# EAGLE design GDEnvSensorNode_1_4b (EAGLE 8.2.1)
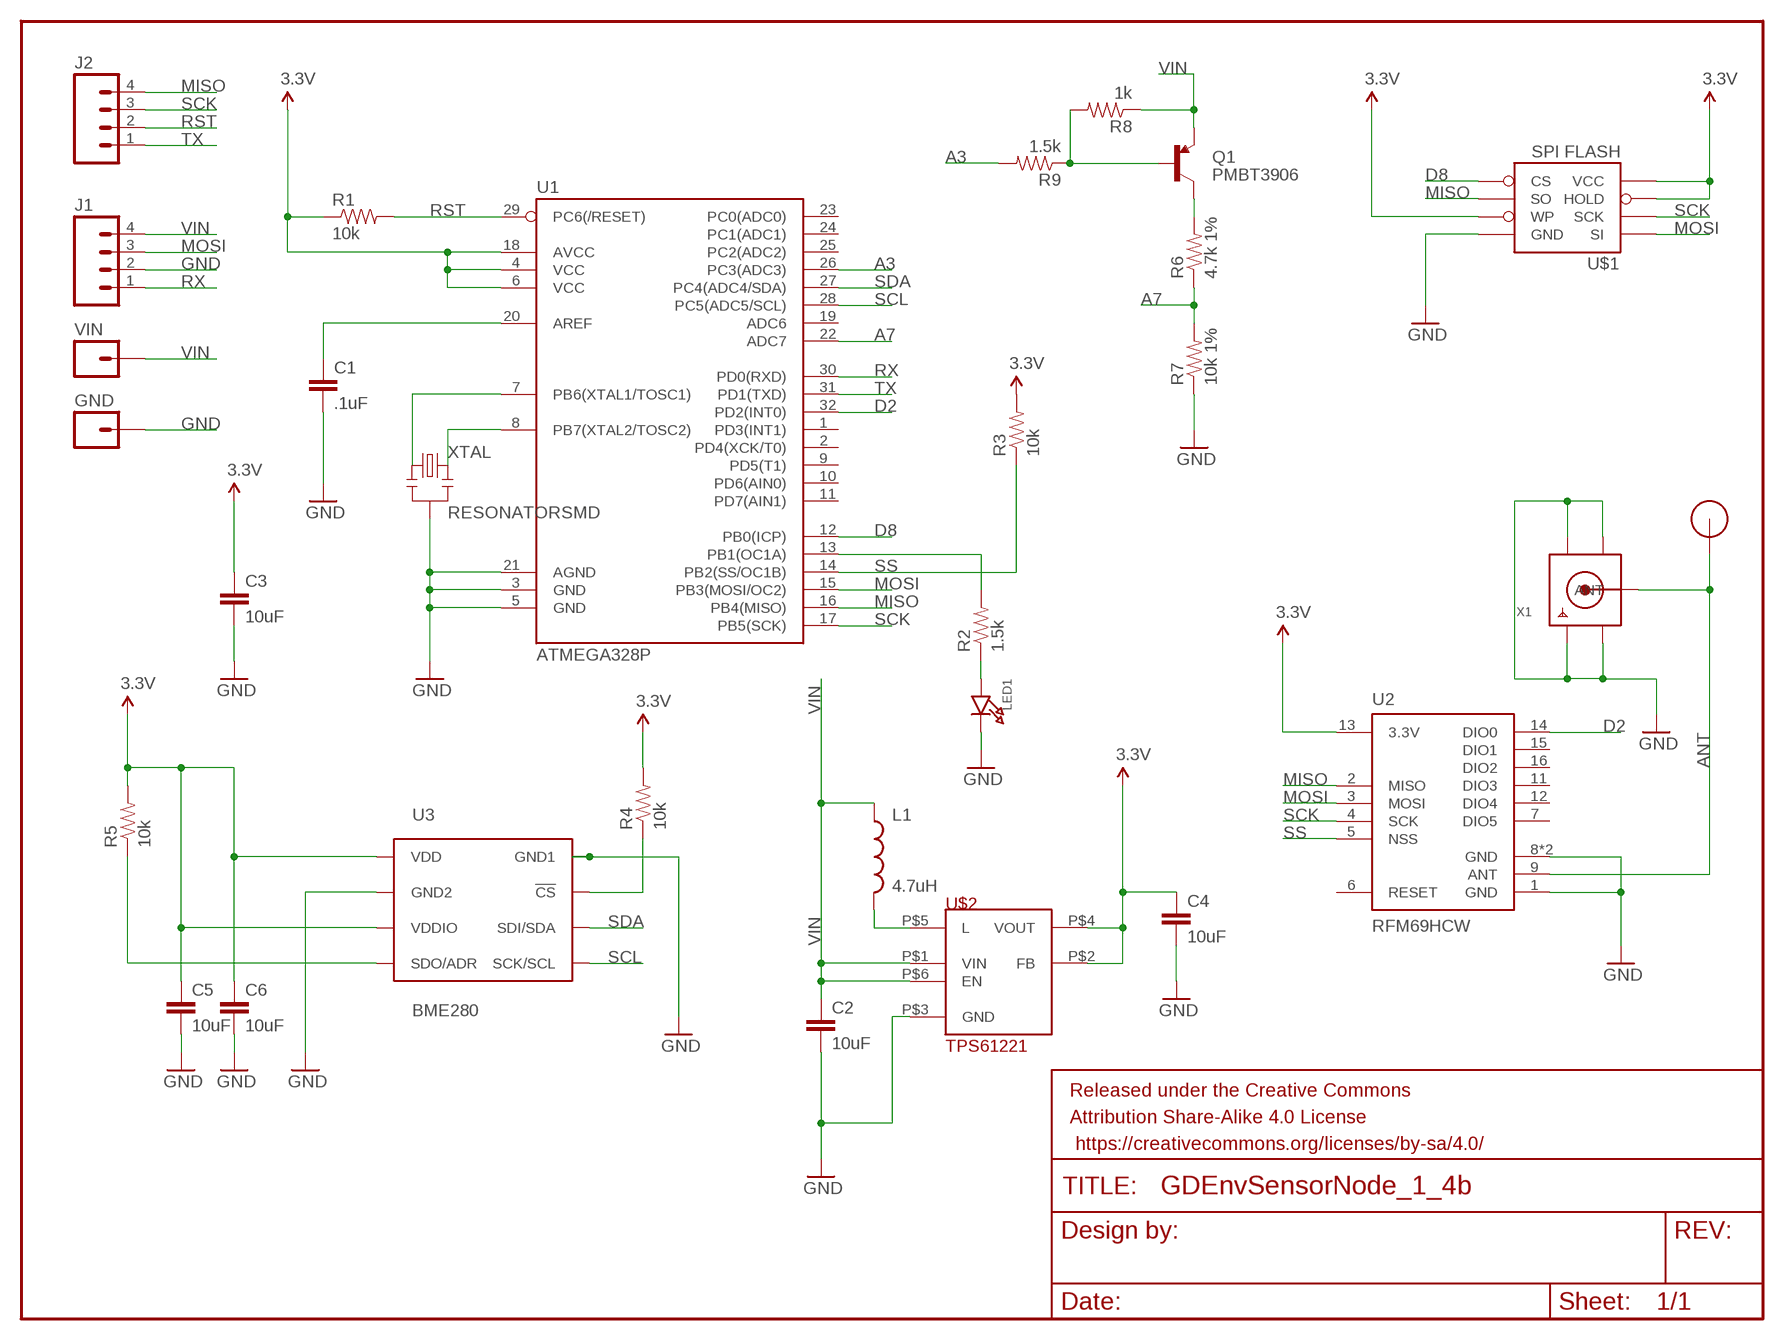
[diagram p0: schematic, sheet 1]

## Parts
C1  .1uF  CAP0805  [0805]
C2  10uF  CAP0805  [0805]
C3  10uF  CAP0805  [0805]
C4  10uF  CAP0805  [0805]
C5  10uF  CAP0805  [0805]
C6  10uF  CAP0805  [0805]
FRAME1  FRAME-LETTER  [CREATIVE_COMMONS]
GND  M01PTH_2MM  [1X01_2MM]
J1  M04PTH  [1X04]
J2  M04PTH  [1X04]
L1  4.7uH  INDUCTOR1210  [1210]
LED1  LED0805  [CHIPLED_0805]
Q1  PMBT3906  TRANSISTOR_PNPPMBT3906  [SOT23-3]
R1  10k  RESISTOR0805-RES  [0805]
R2  1.5k  RESISTOR0805-RES  [0805]
R3  10k  RESISTOR0805-RES  [0805]
R4  10k  RESISTOR0805-RES  [0805]
R5  10k  RESISTOR0805-RES  [0805]
R6  4.7k 1%  RESISTOR0805-RES  [0805]
R7  10k 1%  RESISTOR0805-RES  [0805]
R8  1k  RESISTOR0805-RES  [0805]
R9  1.5k  RESISTOR0805-RES  [0805]
U1  ATMEGA328P  ATMEGA328P_TQFP  [TQFP32-08]
U2  RFM69HCW  [RFM69HCW-XXXS2]
U3  BME280  [BME280_LGA]
U$1  SPI FLASH  AT25F512BJEDEC_3.9MM  [SO08]
U$2  TPS61221  [TPS61221]
U$4  RFM12B_ANTENNA  [RFM12B-ANTENNA]
VIN  M01PTH_2MM  [1X01_2MM]
X1  SMACONNECTOR_EDGE_UFL  [SMA_EDGELAUNCH_UFL]
XTAL  RESONATORSMD  [RESONATOR-SMD]

## Nets
3.3V: C3.1 C4.1 R1.1 R3.2 R4.2 U1.4(VCC) U1.6(VCC) U1.18(AVCC) U2.13(3.3V) U$1.3_WP(WP) U$1.7_HOLD(HOLD) U$1.8_VCC(VCC) U$2.P$2(FB) U$2.P$4(VOUT)
A3: R9.2 U1.26(PC3(ADC3))
A7: R6.1 R7.2 U1.22(ADC7)
ANT: U2.9(ANT) U$4.P$1 X1.P(ANT)
D2: U1.32(PD2(INT0)) U2.14(DIO0)
D8: U1.12(PB0(ICP)) U$1.1_CS(CS)
GND: C1.2 C2.2 C3.2 C4.2 C5.2 C6.2 GND.1 J1.2 LED1.C R7.1 U1.3(GND) U1.5(GND) U1.21(AGND) U2.1(GND) U2.8(GND) U2.10(GND) U3.P$1(GND1) U3.P$7(GND2) U$1.4_GND(GND) U$2.P$3(GND) X1.GND@1(GND1) X1.GND@2(GND2) X1.GND@3(GND3) X1.GND@4(GND4) XTAL.2
L: L1.2 U$2.P$5(L)
MISO: J2.4 U1.16(PB4(MISO)) U2.2(MISO) U$1.2_SO(SO)
MOSI: J1.3 U1.15(PB3(MOSI/OC2)) U2.3(MOSI) U$1.5_SI(SI)
N$1: U1.8(PB7(XTAL2/TOSC2)) XTAL.3
N$2: U1.7(PB6(XTAL1/TOSC1)) XTAL.1
N$3: LED1.A R2.1
N$4: Q1.3(C) R6.2
N$5: R4.1 U3.P$2(!CS)
N$7: Q1.1(B) R8.2 R9.1
N$8: R2.2 U1.13(PB1(OC1A))
N$13: C1.1 U1.20(AREF)
N$15: C5.1 C6.1 R5.2 U3.P$6(VDDIO) U3.P$8(VDD)
N$17: R5.1 U3.P$5(SDO/ADR)
RST: J2.2 R1.2 U1.29(PC6(/RESET))
RX: J1.1 U1.30(PD0(RXD))
SCK: J2.3 U1.17(PB5(SCK)) U2.4(SCK) U$1.6_SCK(SCK)
SCL: U1.28(PC5(ADC5/SCL)) U3.P$4(SCK/SCL)
SDA: U1.27(PC4(ADC4/SDA)) U3.P$3(SDI/SDA)
SS: R3.1 U1.14(PB2(SS/OC1B)) U2.5(NSS)
TX: J2.1 U1.31(PD1(TXD))
VIN: C2.1 J1.4 L1.1 Q1.2(E) R8.1 U$2.P$1(VIN) U$2.P$6(EN) VIN.1
Unconnected: U1.1(PD3(INT1)) U1.2(PD4(XCK/T0)) U1.9(PD5(T1)) U1.10(PD6(AIN0)) U1.11(PD7(AIN1)) U1.19(ADC6) U1.23(PC0(ADC0)) U1.24(PC1(ADC1)) U1.25(PC2(ADC2)) U2.6(RESET) U2.7(DIO5) U2.11(DIO3) U2.12(DIO4) U2.15(DIO1) U2.16(DIO2)

## Library data of the parts
C1-C6 = SparkFun-Capacitors:CAP: Capacitor Standard 0603 ceramic capacitor, and 0.1" leaded capacitor.
FRAME1 = SparkFun-Aesthetics:FRAME-LETTER: Schematic Frame Standard 8.5x11 US Letter frame
GND VIN = SparkFun-Connectors:M01: Header 1 Standard 1-pin 0.1" header. Use with straight break away headers (SKU : PRT-00116), right angle break away headers (PRT-00553), swiss pins (PRT-00743), machine pins (PRT-00117), and female headers (PRT-00115). SMTSO-256-ET is a "flush mount" nut for a 4-40 screw. The older package used to be too tight, and did not allow it to sit properly thru the drill hit. The latest (0.165DIA) fits nice and snug.
J1 J2 = SparkFun-Connectors:M04: Header 4 Standard 4-pin 0.1" header. Use with straight break away headers (SKU : PRT-00116), right angle break away headers (PRT-00553), swiss pins (PRT-00743), machine pins (PRT-00117), and female headers (PRT-00115). Molex polarized connector foot print use with SKU : PRT-08231 with associated crimp pins and housings. 1MM SMD Version SKU: PRT-10208; PROD_ID: CONN-09696
L1 = SparkFun-Passives:INDUCTOR: Inductors Basic Inductor/Choke - 0603 and 1206. Footprints are not proven and vary greatly between part numbers. INDUCTOR POWER 3.3UH 4.0A SMD 0.197" L x 0.197" W x 0.177" H (5.00mm x 5.00mm x 4.50mm)
LED1 = microbuilder:LED: LED 0603 - 0603 Surface Mount Package 2mA: Green LED - Low Power (3.9mcd, 2ma, 1.7Vf) - Digikey: 475-2709-2-ND Orange LED - Low Power (9.8mcd, 2ma, 1.8Vf) - Digikey: 475-1194-2-ND Red LED - Low Power (5mcd, 2ma, 1.8Vf) - Digikey: 475-1195-2-ND Yellow LED - Low Power (7mcd, 2ma, 1.8Vf) - Digikey: 475-1196-2-ND 5mA: Blue LED - Low Power (17mcd, 5ma, 2.9Vf) - Digikey: LNJ937W8CRACT-ND 0805 - 0805 Surface Mount Package 2mA: Red LED (8.8mcd, 2mA, 1.8Vf, Clear) - Low Power [Digikey: 475-2510-1-ND] Green LED (5mcd, 2mA, 1.8Vf, Clear) - Low Power [Digikey: 475-2730-1-ND] Yellow LED (11.3mcd, 2mA, 1.8Vf, Clear) - Low Power [Digikey: 475-2555-1-ND] 20mA: Red LED (104mcd, 20mA, Diffused) - LS R976 [Digikey: 475-1278-6-ND] Red LED (12mcd, 20mA, 2.0Vf, Clear) - APT2012EC [Digikey: 754-1128-1-ND] Green LED (15mcd, 20mA, 2.2Vf, Clear) - APT2012GC [Digikey: 754-1131-1-ND] Orange LED (160mcd, 20mA, 2.1Vf, Clear) - APT2012SECK [Digikey: 754-1130-1-ND] 1206 - 1206 Surface Mount Package Green LED (26mcd, 20mA, Diffused) - LG N971 [Digikey: 475-1407-6-ND] Red LED (15mcd, 20mA, Diffused) - LH N974 [Digikey: 475-1416-6-ND]
Q1 = SparkFun-DiscreteSemi:TRANSISTOR_PNP: Generic PNP BJT Double check pinouts against datasheets- not all devices are the same! MMBT3906 - 40V 200mA SOT-23 (TRANS-08052) MMBT4403 - 40V 600mA SOT-23 (TRANS-09245); PROD_ID: TRANS-08052
R1-R9 = SparkFun-Passives:RESISTOR: Resistor Basic schematic elements and footprints for 0603, 1206, and PTH resistors.
U1 = SparkFun-DigitalIC:ATMEGA328P_TQFP; PROD_ID: IC-09069; VALUE: ATMEGA328P_TQFP
U2 = SparkFun-RF:RFM69H; PROD_ID: IC-11997, IC-12053
U3 = BME280ComponentLibrary:BME280; PROD_ID: IC-13090
U$1 = LowPowerLab:AT25F512B: 4-Mbit SPI flash memory
U$2 = GDTech:TPS61221; AVAILABILITY: Unavailable; DESCRIPTION: the tps6122x family devices provide a power-supply solution for products powered by either a single-cell two-cell or ...; MF: Texas Instruments; MP: TPS61221; PACKAGE: SC-70 Texas Instruments; PRICE: None
U$4 = LowPowerLab:RFM12B_ANTENNA
X1 = adafruit:SMACONNECTOR: SMA Connector 90° DIP SMA Connector, 50 Ohm (4UConnector: 07259)
XTAL = GDTech:RESONATOR: Resonator Small SMD resonator. This is the itty bitty 10/20MHz resonators with built in caps. CSTCE10M0G55 and CSTCE20M0V53. Footprint has been reviewed closely but hasn't been tested yet.

## Board
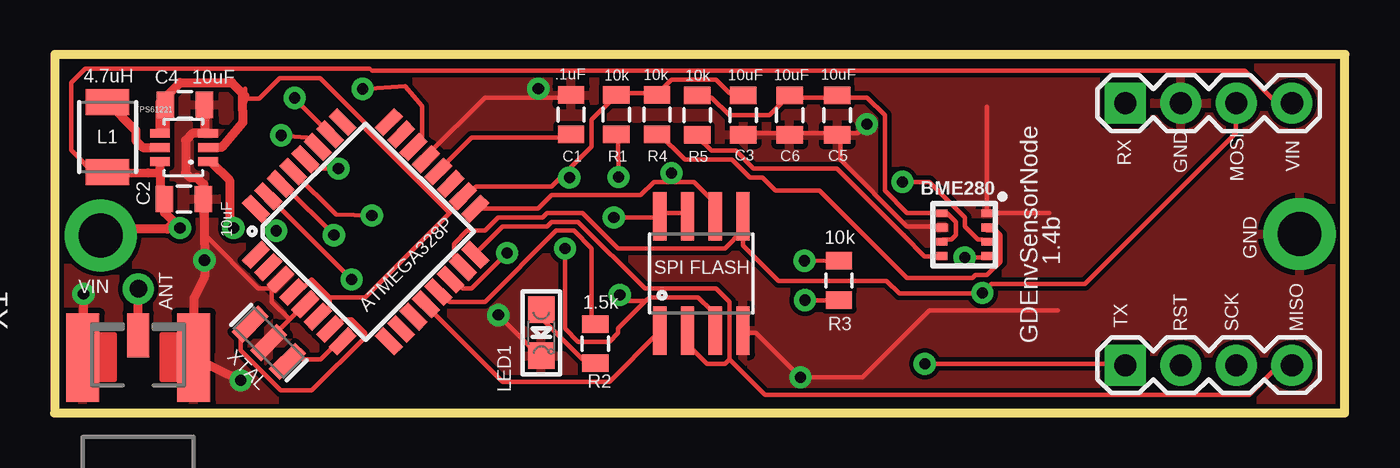
[diagram p1: board, top side]
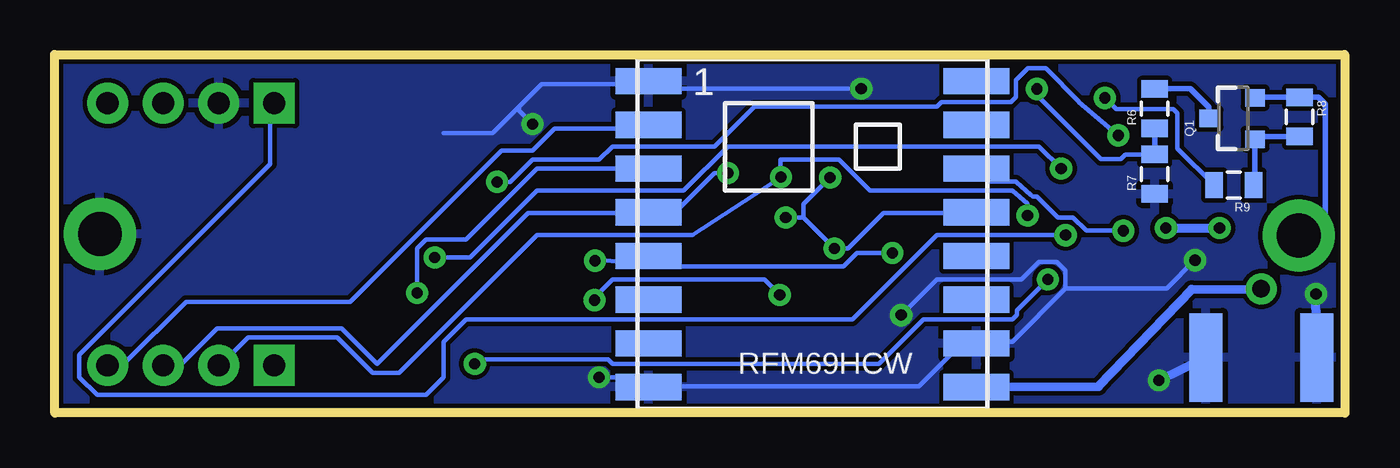
[diagram p2: board, bottom side, seen from below]

Size 59.01 x 16.4 mm. Coordinates in mm from the lower left corner, seen from the top.
Outline: 0,0 59,0 59.01,16.4 0.01,16.4 0,0
Copper layers (1*16): Top 0.035mm / dielectric 1.5mm / Bottom 0.035mm
Design rules "SparkFun": minimum track width 8mil, minimum drill 20mil, track to track 8mil, track to pad 8mil, pad to pad 8mil, via to via 8mil, smd to smd 8mil, copper to edge 8mil, drill to drill 8mil, minimum pad ring 12mil, minimum via ring 10mil, stop-mask expansion 4mil, vias tented up to drill 20mil, thermal gap 10mil

### Footprints (pad centres in the part's own frame; a part is rotated, then mirrored left to right if it is on the bottom)
0805 = smd 0.8 x 1.2: 1 -0.9,0; 2 0.9,0
1X01_2MM = drill 2 pad 3.302: 1 0,0
1X04 = drill 1.016 pad 1.88 square: 1 0,0 | drill 1.016 pad 1.88: 2 2.54,0; 3 5.08,0; 4 7.62,0
1210 = smd 1.2 x 2: 1 -1.6,0; 2 1.6,0
CHIPLED_0805 = smd 1.2 x 1.2: A 0,-1.05; C 0,1.05
SOT23-3 = smd 0.8 x 0.9: 1 -0.95,-1; 2 0.95,-1; 3 0,1.1
TQFP32-08 = smd 1.27 x 0.559: 1 -4.293,2.8; 2 -4.293,2; 3 -4.293,1.2; 4 -4.293,0.4; 5 -4.293,-0.4; 6 -4.293,-1.2; 7 -4.293,-2; 8 -4.293,-2.8; 17 4.293,-2.8; 18 4.293,-2; 19 4.293,-1.2; 20 4.293,-0.4; 21 4.293,0.4; 22 4.293,1.2; 23 4.293,2; 24 4.293,2.8 | smd 0.559 x 1.27: 9 -2.8,-4.293; 10 -2,-4.293; 11 -1.2,-4.293; 12 -0.4,-4.293; 13 0.4,-4.293; 14 1.2,-4.293; 15 2,-4.293; 16 2.8,-4.293; 25 2.8,4.293; 26 2,4.293; 27 1.2,4.293; 28 0.4,4.293; 29 -0.4,4.293; 30 -1.2,4.293; 31 -2,4.293; 32 -2.8,4.293
RFM69HCW-XXXS2 = smd 3 x 1.2: 1 -7.5,7; 2 -7.5,5; 3 -7.5,3; 4 -7.5,1; 5 -7.5,-1; 6 -7.5,-3; 7 -7.5,-5; 8 -7.5,-7; 9 7.5,-7; 10 7.5,-5; 11 7.5,-3; 12 7.5,-1; 13 7.5,1; 14 7.5,3; 15 7.5,5; 16 7.5,7
BME280_LGA = smd 0.5 x 0.35: P$1 1.025,0.975; P$2 1.025,0.325; P$3 1.025,-0.325; P$4 1.025,-0.975; P$5 -1.025,-0.975; P$6 -1.025,-0.325; P$7 -1.025,0.325; P$8 -1.025,0.975
SO08 = smd 0.61 x 2.21: 1_CS -1.905,-2.616; 2_SO -0.635,-2.616; 3_WP 0.635,-2.616; 4_GND 1.905,-2.616; 5_SI 1.905,2.616; 6_SCK 0.635,2.616; 7_HOLD -0.635,2.616; 8_VCC -1.905,2.616
TPS61221 = smd 0.9 x 0.4: P$1 0,0; P$2 0,-0.65; P$3 0,-1.3; P$4 2.2,-1.3; P$5 2.2,-0.65; P$6 2.2,0
RFM12B-ANTENNA = drill 0.8 pad 1.422: P$1 0,0
SMA_EDGELAUNCH_UFL = smd 4.064 x 1.524: GND@1 2.032,-2.54; GND@2 2.032,2.54 | smd 4.064 x 1.524 bottom: GND@3 2.032,2.54; GND@4 2.032,-2.54 | smd 2.032 x 1.016: P 3.048,0
RESONATOR-SMD = smd 0.7 x 1.7: 1 -1.2,0; 2 0,0; 3 1.2,0

### Placement (x,y rotation side)
C1  23.62,13.65 90 top
C2  5.92,9.79 0 top
C3  31.5,13.63 270 top
C4  5.96,14.1 0 top
C5  35.8,13.62 270 top
C6  33.62,13.63 270 top
FRAME1  21.56,-10.71 0 top  (outside the outline)
GND  56.94,8.19 0 top
J1  48.97,14.18 0 top
J2  48.97,2.18 0 top
L1  2.42,12.62 90 top
LED1  22.26,3.67 180 top
Q1  5.11,13.48 90 bottom
R1  25.69,13.66 270 top
R2  24.73,3.17 90 top
R3  35.87,6.06 270 top
R4  27.54,13.65 90 top
R5  29.39,13.63 90 top
R6  8.7,13.93 90 bottom
R7  8.7,10.93 90 bottom
R8  2.07,13.55 270 bottom
R9  5.08,10.43 180 bottom
U1  14.23,8.29 45 top
U2  24.35,8.19 0 bottom
U3  41.6,8.16 0 top
U$1  29.58,6.38 0 top
U$2  7.02,11.5 180 top
U$4  3.83,5.68 0 top
VIN  2.11,8.12 0 top
X1  3.82,0.5 90 top
XTAL  9.79,3.22 315 top

### Tracks (layer width: path | path; a pad name or v marks a point on that pad's centre or on a via)
3.3V  (via drill 0.51, 0.51 pad 1.02)
  Top 0.203: U$1.7_HOLD 28.82,9.15 27.81,9.15 U$1.8_VCC 27.61,8.95 v25.57,8.95 | 27.03,5.12 25.78,3.87 25.78,3.67 25.37,3.26 23.95,3.26 23.34,3.87 v23.34,7.53 | 27.03,5.12 27.2,5.29 29.43,5.29 30.04,4.68 30.04,3.87 U$1.3_WP | C3.1 31.47,14.64 30.86,14.64 30.25,15.25 28.21,15.25 27.61,14.64 R4.2 27.4,14.64 25.78,14.64 R1.1 25.57,14.44 24.56,13.42 24.56,12.2 23.34,10.98 | 7.23,12.15 U$2.P$2 | 8.6,14.51 8.66,14.56 | 12.57,5.29 11.76,6.1 11.35,5.7 10.94,5.7 U1.4 | 12.57,5.29 12.57,4.89 12.16,4.48 U1.6 | 18.05,9.15 14.19,5.29 12.57,5.29 | 18.05,9.15 18.66,9.76 U1.18 18.87,9.97 19.27,10.37 22.73,10.37 23.34,10.98 | 18.05,9.15 14.19,13.01 14.19,13.28 12.69,14.78 12.68,14.78 12.14,15.32 10.28,15.32 9.35,14.39 8.75,14.39 8.6,13.81 | 8.71,14.84 8.71,14.51 | 23.34,10.98 v23.54,10.78 | v34.32,5.16 R3.2 | 27.03,5.12 26.12,5.12 v25.85,5.4
  Top 0.406: C4.1 5.06,13.04 U$2.P$4 4.82,14.21 5.73,15.12 8.1,15.12 8.66,14.56 8.71,14.51 | 7.23,12.15 7.64,12.15 8.6,13.29 8.6,13.81 8.6,14.51
  Bottom 0.203: U2.13 17.04,9.15 21.1,9.15 22.73,7.53 v23.34,7.53 24.76,8.95 | 24.76,8.95 v25.57,8.95 | 24.76,8.95 24.76,9.56 v23.54,10.78 | v34.32,5.16 34.51,5.09 33.5,6.1 26.55,6.1 v25.85,5.4
A3  (via drill 0.51 pad 1)
  Top 0.203: U1.26 12.6,12.77 11,14.37 11,14.4 v10.98,14.42
  Bottom 0.203: R9.2 7.66,12.11 7.66,13.72 7.84,13.9 10.46,13.9 v10.98,14.42
A7  (via drill 0.51 pad 1)
  Top 0.203: 16.41,12.19 U1.22 16.8,12.57 16.8,14.05 16.03,14.95 v14.08,14.83
  Bottom 0.203: v14.08,14.83 14.07,14.53 13.4,13.87 11.15,11.62 10.24,11.62 10.03,11.83 R7.2
  Bottom 0.254: R7.2 R6.1
ANT
  Top 0.406: X1.P 3.83,5.07 U$4.P$1
  Bottom 0.203: 16.43,1.63 16.84,1.23 U2.9
  Bottom 0.406: U2.9 11.27,1.22 7.01,5.66 U$4.P$1
D2  (via drill 0.51)
  Top 0.203: v10.13,8.34 9.32,9.15 U1.32
  Bottom 0.203: 16.84,11.19 U2.14 16.25,10.59 15.06,10.59 15.04,10.57 15.03,10.56 14.35,9.98 14.28,9.91 14.08,9.91 13.12,8.95 12.44,8.95 11.83,8.34 v10.13,8.34
D8
  Top 0.203: U1.12 17.04,4.89 20.49,1.43 25.37,1.43 27.61,3.67 U$1.1_CS
GND  (via drill 0.51, 0.51 pad 1)
  Top 0.203: 10.74,4.28 9.72,3.26 XTAL.2 | 10.74,4.28 11.35,4.89 U1.5 | 9.93,5.7 U1.3 9.93,5.7 | 9.93,5.7 9.93,5.09 10.74,4.28 | 9.93,5.7 9.32,5.7 6.88,8.14 6.98,9.64 C2.2 | U$1.4_GND 31.67,3.67 32.08,3.67 v34.11,1.63 36.95,1.63 40,4.68 45.89,4.68 | v20.29,4.48 22.12,2.65 LED1.C | 45.49,9.15 42.64,9.15 | C3.2 31.67,12.81 33.5,12.81 C6.2 33.7,12.81 35.73,12.81 C5.2 | U3.P$7 40.41,8.54 38.98,8.54 35.94,11.59 35.94,12.61 C5.2 | 22.12,14.44 19.68,14.44 17.04,11.79 U1.21 | 22.12,14.44 23.54,14.44 C1.2 | v22.12,14.84 22.12,14.44 | v37.16,13.22 36.75,12.81 35.94,12.81 C5.2 | 42.64,14.03 42.64,9.15 | 42.64,9.15 U3.P$1
  Top 0.406: C4.2 6.86,12.96 U$2.P$3 6.32,12.8 5.99,12.47 5.99,10.98 6.19,10.78 6.5,10.78 6.82,10.46 C2.2 | C2.2 | v1.32,5.45 1.31,4.45 1.1,4.11 | X1.GND@1 v8.51,1.49 | C2.2 v6.85,6.99 6.86,6.25 6.36,5.25 6.36,4.11
  Bottom 0.203: v34.11,1.63 32.28,1.63 31.87,1.23 U2.8 31.67,1.23 19.48,1.23 17.65,3.06 17.04,3.06 U2.10 16.84,3.26 15.21,3.26 12.77,5.7 | v20.29,4.48 18.66,6.1 14.8,6.1 13.99,6.92 13.18,6.92 12.77,6.51 12.77,5.7 | 37.77,14.03 38.98,12.81 41.22,12.81 | 37.77,14.03 36.75,15.05 31.87,15.05 U2.1 31.67,15.05 31.47,14.84 v22.12,14.84 | v37.16,13.22 37.77,13.83 37.77,14.03 | 12.77,5.7 8.14,5.7 v6.85,6.99
  Bottom 0.406: X1.GND@2 v1.32,5.45 | v8.51,1.49 X1.GND@1
  pour Bottom: 0.06,16.44 59.06,16.44 59,0 0,0
  pour Top: 0.06,16.42 59.06,16.42 59.03,0.02 0.03,0.02
L
  Top 0.406: L1.2 3.71,12.93 3.71,12.47 4.03,12.15 U$2.P$5
MISO
  Top 0.203: 30.86,2.45 30.86,5.09 30.25,5.7 27,5.7 23.95,8.75 22.73,8.75 22.52,8.54 20.49,8.54 19.27,7.32 U1.16 | 30.86,2.45 30.65,2.24 29.84,2.24 29.03,3.06 29.03,3.67 U$1.2_SO | 30.86,2.45 32.48,0.82 54.63,0.82 55.85,2.04 56.46,2.04 J2.4
  Bottom 0.203: U2.2 31.87,13.01 36.14,13.01 37.16,12 38.58,12 45.49,5.09 53,5.09 55.85,2.24 56.46,2.24 J2.4
MOSI  (via drill 0.51)
  Top 0.203: 31.47,8.34 30.65,7.53 25.78,7.53 24.15,9.15 22.52,9.15 22.32,8.95 20.29,8.95 19.68,8.34 18.87,8.34 18.26,7.73 18.26,7.12 18.66,6.71 U1.15 | 31.47,8.34 31.47,8.95 U$1.5_SI | 31.47,8.34 U$1.5_SI | U$1.5_SI 31.48,7.66 33.1,6.05 38.05,6.05 38.64,5.46 42.4,5.46 v42.44,5.5 42.84,5.9 47.11,5.9 54.02,12.81 54.02,14.03 J1.3
  Bottom 0.203: v42.44,5.5 42.44,7.53 42.03,7.93 40.2,7.93 36.95,11.19 31.87,11.19 U2.3
N$1
  Top 0.203: U1.8 12.98,3.26 12.16,2.45 10.74,2.45 XTAL.3
N$2
  Top 0.203: U1.7 12.77,3.87 13.18,4.28 13.58,4.28 14.19,3.67 14.19,3.46 11.76,1.03 10.33,1.03 8.5,2.85 8.5,3.46 8.91,3.87 XTAL.1
N$3
  Top 0.203: R2.1 24.56,2.45 24.15,2.45 22.32,4.28 22.32,4.68 LED1.A
N$4
  Bottom 0.254: Q1.3 6.21,13.99 7.07,14.85 8.68,14.85 R6.2
N$5
  Top 0.203: U3.P$2 42.64,8.34 43.05,8.34 43.25,8.14 43.25,6.92 42.64,6.31 42.1,6.31 41.97,6.18 38.97,6.18 34.97,10.18 32.97,10.18 32.38,10.77 31.8,10.77 30.98,11.59 28.82,11.59 27.61,12.81 R4.1
N$7
  Bottom 0.254: R8.2 3.99,12.65 Q1.1 4.11,10.5 R9.1
N$8
  Top 0.203: R2.2 24.56,4.07 24.56,7.53 23.74,8.34 22.93,8.34 19.68,5.09 18.05,5.09 17.65,5.5 U1.13
N$13
  Top 0.203: C1.1 23.54,12.61 19.07,12.61 17.65,11.19 U1.20
N$15
  Top 0.203: U3.P$6 40.61,7.93 41.02,7.93 41.22,8.14 41.22,8.75 40.81,9.15 40.61,9.15 U3.P$8 40.41,9.15 38.98,9.15 37.97,10.17 37.97,13.62 37.16,14.44 35.94,14.44 C5.1 35.73,14.44 33.7,14.44 C6.1 33.5,14.44 32.69,13.62 30.86,13.62 30.04,14.44 29.43,14.44 R5.2
N$17
  Top 0.203: R5.1 29.43,12.61 30.04,12 31.15,12 31.97,11.18 35.77,11.18 38.82,8.14 38.83,8.14 38.84,8.13 38.84,8.11 39.78,7.17 40.56,7.17 U3.P$5
RST  (via drill 0.51)
  Top 0.203: v25.79,10.8 25.78,12.61 R1.2 | v14.51,9.04 12.87,9.08 10.94,10.98 U1.29
  Bottom 0.203: v14.51,9.04 14.52,9.58 15.21,10.17 21.71,10.17 23.13,11.59 25.8,11.59 v25.79,10.8 26.5,10.31 29.84,8.14 36.95,8.14 43.25,1.84 44.47,1.84 46.1,3.46 50.16,3.46 51.38,2.24 J2.2
RX  (via drill 0.51)
  Top 0.203: v12.77,8.14 10.54,10.37 U1.30
  Bottom 0.203: v12.77,8.14 18.66,8.14 22.52,4.28 40.2,4.28 41.22,3.26 41.22,1.63 42.03,0.82 57.07,0.82 57.88,1.63 57.88,2.65 49.14,11.39 49.14,14.03 J1.1
SCK  (via drill 0.51)
  Top 0.203: 28.21,10.57 29.23,10.57 30.04,9.76 30.04,9.15 U$1.6_SCK | 28.21,10.57 27.4,10.57 26.79,9.97 22.73,9.97 22.12,9.36 19.27,9.36 U1.17 | v28.21,10.98 28.21,10.57
  Bottom 0.203: v28.21,10.98 28.82,10.98 30.45,9.36 31.67,9.36 U2.4 31.87,9.15 37.36,9.15 44.27,2.24 45.89,3.87 51.58,3.87 53.21,2.24 54.02,2.24 J2.3
SCL  (via drill 0.51)
  Top 0.203: v41.63,7.12 42.44,7.12 U3.P$4 | v12.98,11.19 11.96,11.19 11.55,11.59 U1.28
  Bottom 0.203: v41.63,7.12 40,7.12 36.95,10.17 30.25,10.17 28.21,12.2 13.99,12.2 v12.98,11.19
SDA  (via drill 0.51)
  Top 0.203: v38.78,10.57 40,10.57 41.63,8.95 41.63,8.54 42.24,7.93 42.44,7.93 U3.P$3 | v10.36,12.7 11.55,12.61 11.96,12.2 U1.27
  Bottom 0.203: v38.78,10.57 38.17,10.57 37.16,11.59 34.11,11.59 33.5,12.2 28.82,12.2 27,14.03 18.66,14.03 18.46,14.23 15.27,14.23 15.15,14.36 | v10.36,12.7 12.16,14.23 12.16,14.25 13.68,15.77 14.5,15.77 15.04,15.23 15.04,14.46 | 15.15,14.36 15.04,14.46 | 15.15,14.36 15.04,14.46
SS  (via drill 0.51, 0.51 pad 1.02)
  Top 0.203: v20.7,7.32 19.07,5.7 18.66,5.7 18.26,6.1 U1.14 | v34.29,6.97 R3.1
  Bottom 0.203: v20.7,7.32 22.32,7.32 22.93,6.71 31.26,6.71 31.67,7.12 U2.5 31.87,7.12 32.08,6.92 v34.29,6.97
TX  (via drill 0.51)
  Top 0.203: v13.58,6.1 9.93,9.76 U1.31 | v39.8,2.24 48.94,2.24 J2.1
  Bottom 0.203: v13.58,6.1 15.01,4.68 15.01,4.48 15.21,4.28 19.27,4.28 21.31,2.24 33.5,2.24 33.7,2.45 39.59,2.45 v39.8,2.24
VIN  (via drill 0.51 pad 1)
  Top 0.203: J1.4 56.46,14.23 55.85,14.23 54.43,15.66 17.74,15.66 | 7.18,11.46 U$2.P$1 | 17.74,15.66 | 17.74,15.66 14.52,15.66 14.42,15.76 1.4,15.76 0.75,15.11 0.75,12.02 1.93,10.84 2.24,10.84 L1.1
  Top 0.406: 4.82,11 U$2.P$6 | 4.82,11 4.82,9.99 C2.1 5.03,9.78 5.03,9.17 5.47,8.73 | L1.1 4.27,10.99 4.82,11 | v5.73,8.47 5.47,8.73 | 7.18,11.46 8,10.65 8,8.65 v8.18,8.47 | 5.47,8.73 5.15,8.42 2.84,8.42 VIN.1
  Bottom 0.254: Q1.2 4.09,14.45 R8.1 1.21,14.45 0.9,14.14 0.9,9.1 VIN.1
  Bottom 0.406: v8.18,8.47 v5.73,8.47

### Text on the board
tPlace: RX | GND | VIN | MOSI | TX | RST | SCK | MISO
tNames: 1.4b | GDEnvSensorNode